# Altium schematic sheet stm32f103cb_hm_F100.SchDoc: Schemat z procesorem STM32F100CBT6
size A4; DocumentNumber: 2; SheetNumber: 2; SheetTotal: 4; LotOfPieces: 1
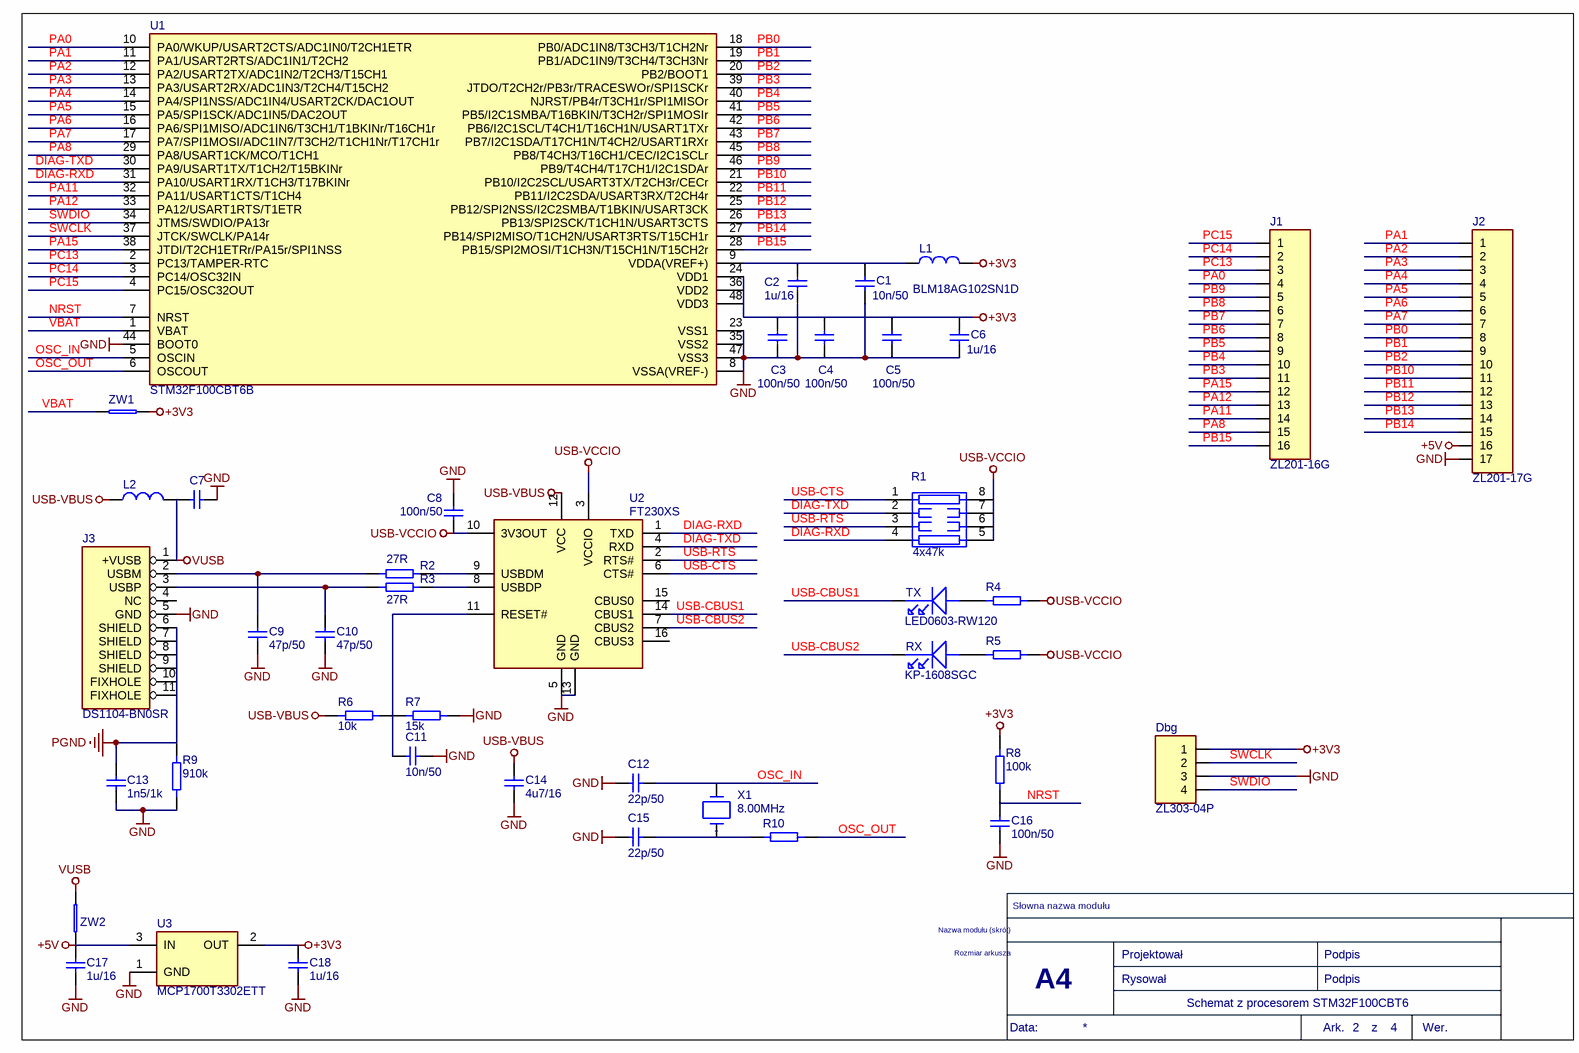
[diagram p0: stm32f103cb_hm_F100.SchDoc]

## Parts
C1  10n/50  [0603-IPC]  (graphical)
C2  1u/16  [0603-IPC]  (graphical)
C3  100n/50  [0603-IPC]  (graphical)
C4  100n/50  [0603-IPC]  (graphical)
C5  100n/50  [0603-IPC]  (graphical)
C6  1u/16  [0603-IPC]  (graphical)
C7  10n/50  [0603-IPC]  (value not drawn)  (graphical)
C8  100n/50  [0603-IPC]  (graphical)
C9  47p/50  [0603-IPC]  (graphical)
C10  47p/50  [0603-IPC]  (graphical)
C11  10n/50  [0603-IPC]  (graphical)
C12  22p/50  [0603-IPC]  (graphical)
C13  1n5/1k  [1210]  (graphical)
C14  4u7/16  [0805]  (graphical)
C15  22p/50  [0603-IPC]  (graphical)
C16  100n/50  [0603-IPC]  (graphical)
C17  1u/16  [0603-IPC]  (graphical)
C18  1u/16  [0603-IPC]  (graphical)
Dbg  ZL303-04P  [PLMS4S]  (graphical)
J1  ZL201-16G  [PLS16S]  (graphical)
J2  ZL201-17G  [PLS17S]  (graphical)
J3  DS1104-BN0SR  [USBMS1B5]  (graphical)
L1  BLM18AG102SN1D  [0603-IPC]  (graphical)
L2  BLM18AG102SN1D  [0603-IPC]  (value not drawn)  (graphical)
R1  4x47k  [1206RP]  (graphical)
R2  27R  [0603R]  (graphical)
R3  27R  [0603R]  (graphical)
R4  10k  [0603R]  (value not drawn)  (graphical)
R5  10k  [0603R]  (value not drawn)  (graphical)
R6  10k  [0603R]  (graphical)
R7  15k  [0603R]  (graphical)
R8  100k  [0603R]  (graphical)
R9  910k  [2512]  (graphical)
R10  220R  [0603R]  (value not drawn)  (graphical)
RX  KP-1608SGC  [D0603]  (graphical)
TX  LED0603-RW120  [D0603]  (graphical)
U1  STM32F100CBT6B  [MS-026ABC]  (graphical)
U2  FT230XS  [MO-137AB]  (graphical)
U3  MCP1700T3302ETT  [SOT23-3]  (graphical)
X1  8.00MHz  [HC49/4HSMX_THT]  (graphical)
ZW1  SHORT0805  [SHORT0805]  (value not drawn)  (graphical)
ZW2  SHORT0805  [SHORT0805]  (value not drawn)  (graphical)

## Nets
+3V3: C3.1 C4.1 C5.1 C6.1 C18.1 Dbg.1 L1.2 R8.1 U1.24(VDD1) U1.36(VDD2) U1.48(VDD3) U3.2(OUT) ZW1.2
+5V: C17.1 J2.16 U3.3(IN) ZW2.1
GND: C1.2 C2.2 C3.2 C4.2 C5.2 C6.2 C7.1 C8.1 C9.2 C10.2 C11.1 C12.1 C13.2 C14.2 C15.1 C16.2 C17.2 C18.2 Dbg.3 J2.17 J3.5(GND) R7.2 R9.2 U1.8(VSSA(VREF-)) U1.23(VSS1) U1.35(VSS2) U1.44(BOOT0) U1.47(VSS3) U2.5(GND) U2.13(GND) U3.1(GND)
PGND: C13.1 J3.6(SHIELD) J3.7(SHIELD) J3.8(SHIELD) J3.9(SHIELD) J3.10(FIXHOLE) J3.11(FIXHOLE) R9.1
USB-VBUS: C14.1 L2.2 R6.1 U2.12(VCC)
USB-VCCIO: C8.2 R1.5(R5) R1.6(R6) R1.7(R7) R1.8(R8) R4.2 R5.2 U2.3(VCCIO) U2.10(3V3OUT)
VUSB: C7.2 J3.1(+VUSB) L2.1 ZW2.2
DIAG-RXD: R1.4(R4) U1.31(PA10/USART1RX/T1CH3/T17BKINr) U2.1(TXD)
DIAG-TXD: R1.2(R2) U1.30(PA9/USART1TX/T1CH2/T15BKINr) U2.4(RXD)
NRST: C16.1 R8.2 U1.7(NRST)
OSC_IN: C12.2 U1.5(OSCIN) X1.1
OSC_OUT: R10.2 U1.6(OSCOUT)
PA0: J1.4 U1.10(PA0/WKUP/USART2CTS/ADC1IN0/T2CH1ETR)
PA1: J2.1 U1.11(PA1/USART2RTS/ADC1IN1/T2CH2)
PA2: J2.2 U1.12(PA2/USART2TX/ADC1IN2/T2CH3/T15CH1)
PA3: J2.3 U1.13(PA3/USART2RX/ADC1IN3/T2CH4/T15CH2)
PA4: J2.4 U1.14(PA4/SPI1NSS/ADC1IN4/USART2CK/DAC1OUT)
PA5: J2.5 U1.15(PA5/SPI1SCK/ADC1IN5/DAC2OUT)
PA6: J2.6 U1.16(PA6/SPI1MISO/ADC1IN6/T3CH1/T1BKINr/T16CH1r)
PA7: J2.7 U1.17(PA7/SPI1MOSI/ADC1IN7/T3CH2/T1CH1Nr/T17CH1r)
PA8: J1.15 U1.29(PA8/USART1CK/MCO/T1CH1)
PA11: J1.14 U1.32(PA11/USART1CTS/T1CH4)
PA12: J1.13 U1.33(PA12/USART1RTS/T1ETR)
PA15: J1.12 U1.38(JTDI/T2CH1ETRr/PA15r/SPI1NSS)
PB0: J2.8 U1.18(PB0/ADC1IN8/T3CH3/T1CH2Nr)
PB1: J2.9 U1.19(PB1/ADC1IN9/T3CH4/T3CH3Nr)
PB2: J2.10 U1.20(PB2/BOOT1)
PB3: J1.11 U1.39(JTDO/T2CH2r/PB3r/TRACESWOr/SPI1SCKr)
PB4: J1.10 U1.40(NJRST/PB4r/T3CH1r/SPI1MISOr)
PB5: J1.9 U1.41(PB5/I2C1SMBA/T16BKIN/T3CH2r/SPI1MOSIr)
PB6: J1.8 U1.42(PB6/I2C1SCL/T4CH1/T16CH1N/USART1TXr)
PB7: J1.7 U1.43(PB7/I2C1SDA/T17CH1N/T4CH2/USART1RXr)
PB8: J1.6 U1.45(PB8/T4CH3/T16CH1/CEC/I2C1SCLr)
PB9: J1.5 U1.46(PB9/T4CH4/T17CH1/I2C1SDAr)
PB10: J2.11 U1.21(PB10/I2C2SCL/USART3TX/T2CH3r/CECr)
PB11: J2.12 U1.22(PB11/I2C2SDA/USART3RX/T2CH4r)
PB12: J2.13 U1.25(PB12/SPI2NSS/I2C2SMBA/T1BKIN/USART3CK)
PB13: J2.14 U1.26(PB13/SPI2SCK/T1CH1N/USART3CTS)
PB14: J2.15 U1.27(PB14/SPI2MISO/T1CH2N/USART3RTS/T15CH1r)
PB15: J1.16 U1.28(PB15/SPI2MOSI/T1CH3N/T15CH1N/T15CH2r)
PC13: J1.3 U1.2(PC13/TAMPER-RTC)
PC14: J1.2 U1.3(PC14/OSC32IN)
PC15: J1.1 U1.4(PC15/OSC32OUT)
SWCLK: Dbg.2 U1.37(JTCK/SWCLK/PA14r)
SWDIO: Dbg.4 U1.34(JTMS/SWDIO/PA13r)
USB-CBUS1: TX.CATH U2.14(CBUS1)
USB-CBUS2: RX.CATH U2.7(CBUS2)
USB-CTS: R1.1(R1) U2.6(CTS#)
USB-RTS: R1.3(R3) U2.2(RTS#)
VBAT: U1.1(VBAT) ZW1.1
NetC1_1: C1.1 C2.1 L1.1 U1.9(VDDA(VREF+))
NetC9_1: C9.1 J3.2(USBM) R2.1
NetC10_1: C10.1 J3.3(USBP) R3.1
NetC11_2: C11.2 R6.2 R7.1 U2.11(RESET#)
NetC15_2: C15.2 R10.1 X1.2
NetR2_2: R2.2 U2.9(USBDM)
NetR3_2: R3.2 U2.8(USBDP)
NetR4_1: R4.1 TX.ANOD
NetR5_1: R5.1 RX.ANOD

Not connected (* = marked no-connect by the designer): J3 4(NC); U2 15(CBUS0) 16(CBUS3)

## Notes on the sheet
- Nazwa modułu (skrót)
- Słowna nazwa modułu
- Rozmiar arkusza
- A4
- Projektował
- Rysował
- Podpis
- Data:
- Ark.
- z
- Wer.

## Library data of the parts
C1 C7 C11 = CAP20: Descript: Kondensator: ceramiczny; MLCC; 10nF; 50V; X7R; ±10%; SMD; 0603; Reference5: 06035C103KAT2A; Kod: CAP20; ID: 20; Value: 10n/50; Supplier5: tme.pl; Manufacturer5: AVX; Typ5: 06035C103KAT2A; Price5: 0,08; DateOfPrice5: 2020-05-10
C2 C6 C17 C18 = CAP37: Descript: Kondensator: ceramiczny; MLCC; 1uF; 16V; X7R; ±10%; SMD; 0603; Reference5: CL10B105KO8NNNC; Kod: CAP37; ID: 37; Value: 1u/16; Supplier5: tme.pl; Manufacturer5: Samsung; Typ5: CL10B105KO8NNNC; Price5: 0,07; DateOfPrice5: 2020-05-10
C3-C5 C8 C16 = CAP6: Descript: Kondensator: ceramiczny; MLCC; 100nF; 50V; X7R; ±5%; SMD; 0603; Reference5: CL10B104JB8NNNC; Kod: CAP6; ID: 6; Value: 100n/50; Supplier5: tme.pl; Manufacturer5: Samsung; Typ5: CL10B104JB8NNNC; Price5: 0,25; DateOfPrice5: 2020-05-10
C9 C10 = CAP85: Descript: Kondensator: ceramiczny; MLCC; 47pF; 50V; C0G; ±5%; SMD; 0603; Reference5: CC0603JRNPO9470; Typ5: CC0603JRNPO9BN470; Kod: CAP85; ID: 85; Value: 47p/50; Supplier5: tme.pl; Manufacturer5: Yageo; Price5: 0,08; DateOfPrice5: 2020-05-10
C12 C15 = CAP53: Descript: Kondensator: ceramiczny; MLCC; 22pF; 50V; C0G; ±5%; SMD; 0603; Reference5: CC0603JRNPO9220; Typ5: CC0603JRNPO9BN220; Kod: CAP53; ID: 53; Value: 22p/50; Supplier5: tme.pl; Manufacturer5: Yageo; Price5: 0; DateOfPrice5: 2010-01-01
C13 = CAP35: Descript: Ceramiczny kondensator wielowarstw. SMD, 1210 [jedn. metryczne: 3225], 1500 pF, 1 kV, ± 10%, X7R; Reference5: 1855964; Typ5: MCCA000836; Kod: CAP35; ID: 35; Value: 1n5/1k; DateOfPrice5: 2020-05-10; Manufacturer5: MULTICOMP; Price5: 2,4; Supplier5: farnell.com
C14 = CAP97: Descript: Kondensator: ceramiczny; MLCC; 4,7uF; 16VDC; X7R; ±5%; SMD; 0805; Reference5: C0805C475J4RACAUTO; Kod: CAP97; ID: 97; Value: 4u7/16; Supplier5: tme.pl; Manufacturer5: Kemet; Typ5: C0805C475J4RACAUTO; Price5: 1,5; DateOfPrice5: 2020-05-10
Dbg = Con298: Descript: Listwa kołkowa; kołkowe; męskie; PIN:4; proste; 2mm; THT; 1x4; Kod: Con298; ID: 298; Replacement: bd; Value: ZL303-04P; Supplier5: tme.pl; Reference5: ZL303-04P; Manufacturer5: Ninigi; Typ5: ZL303-04P; Price5: 0,2; DateOfPrice5: 2020-05-10
J1 = CON81: Kod: CON81; ID: 81; Descript: Listwa kołkowa; kołkowe; męskie; PIN: 16; proste; 2,54mm; THT; 1x16; Typ5: DS1021-1*16SF11; Replacement: bd; Value: ZL201-16G; Price5: 0,7; DateOfPrice5: 2020-12-08; Supplier5: tme; Reference5: ZL201-16G; Manufacturer5: Connfly
J2 = CON82: Kod: CON82; ID: 82; Descript: Listwa kołkowa; kołkowe; męskie; PIN: 20; proste; 2,54mm; THT; 1x20; Reference5: ZL201-20G; Typ5: DS1021-1*20SF11; Replacement: bd; Value: ZL201-17G; Price5: 1; DateOfPrice5: 2020-12-08; Supplier5: tme; Manufacturer5: Connfly
J3 = Con41: Descript: Gniazdo; USB B mini; SMT; PIN: 5; poziome; Opakowanie: taśma; Reference5: MUSB-G5P; Replacement: bd; Kod: Con41; ID: 41; Value: DS1104-BN0SR; Supplier5: tme.pl; Manufacturer5: Connfly; Price5: 2; DateOfPrice5: 2010-01-01; Typ5: DS1104-BN0SR
L1 L2 = Ind41: Descript: Ferryt: koralik; Imp.@ 100MHz:1000om; Montaż: SMD; 0,4A; Obud:0603; Kod: Ind41; ID: 41; Value: BLM18AG102SN1D; Supplier5: tme.pl; Reference5: BLM18AG102SN1D; Manufacturer5: Murata; Typ5: BLM18AG102SN1D; Price5: 0; DateOfPrice5: 2020-05-10; InductCurr: -
R1 = Res182: Descript: Drabinka rezystorowa: Y; 47kΩ; SMD; 1206; Il.rezystorów:4; 63mW; Reference5: DR1206-47K-4/8; Typ5: 4D03WGJ0473T; Kod: Res182; ID: 182; Value: 4x47k; Supplier5: tme.pl; Manufacturer5: Royal Ohm; Price5: 0,1; DateOfPrice5: 2020-05-10
R2 R3 = Res106: Descript: Rezystor: thick film; SMD; 0603; 27Ω; 0,1W; ±1%; -55÷125°C; Reference5: SMD0603-27R-1%; Typ5: 0603SAF270JT5E; Kod: Res106; ID: 106; Value: 27R; Supplier5: tme.pl; Manufacturer5: Royal Ohm; Price5: 0,1; DateOfPrice5: 2020-05-10
R4-R6 = Res15: Descript: Rezystor: thick film; SMD; 0603; 10kom; 0,1W; ±1%; -55÷125°C; Reference5: SMD0603-10K-1%; Typ5: 0603WGF 10K T5E; Kod: Res15; ID: 15; Value: 10k; Supplier5: tme.pl; Manufacturer5: Royal Ohm; Price5: 0,08; DateOfPrice5: 2020-05-10
R7 = Res39: Descript: Rezystor: thick film; SMD; 0603; 15kΩ; 0,1W; ±1%; -55÷125°C; Reference5: SMD0603-15K-1%; Typ5: 0603WGF15KT5E; Kod: Res39; ID: 39; Value: 15k; Supplier5: tme.pl; Manufacturer5: Royal Ohm; Price5: 0,08; DateOfPrice5: 2020-05-10
R8 = Res9: Descript: Rezystor: thick film; SMD; 0603; 100kom; 0,1W; ±1%; -55÷125°C; Reference5: SMD0603-100K-1%; Typ5: 0603SAF1003T5E; Kod: Res9; ID: 9; Value: 100k; Supplier5: tme.pl; Manufacturer5: Royal Ohm; Price5: 0,1; DateOfPrice5: 2020-06-25
R9 = Res235: Descript: Rezystor SMD, grubowarstwowy, 2512 [jedn. metryczne: 6432], 910 kohm, Seria ERJU1T, 200 V; Reference5: 2381073; Typ5: ERJU1TF9103U; Kod: Res235; ID: 235; Value: 910k; Supplier5: farnell; Price5: 1,14; DateOfPrice5: 2020-05-10; Manufacturer5: Panasonic
R10 = Res87: Descript: Rezystor: thick film; SMD; 0603; 220om; 0,1W; ±1%; -55÷125°C; Reference5: SMD0603-220R-1%; Typ5: 0603SAF2200T5E; Kod: Res87; ID: 87; Value: 220R; Supplier5: tme.pl; Manufacturer5: Royal Ohm; Price5: 0,1; DateOfPrice5: 2020-06-25
RX = Opt8: Descript: LED; SMD; 0603; zielony; 4-15mcd; 120°; 1,6x0,8mm; Kod: Opt8; ID: 8; Value: KP-1608SGC; Supplier5: tme.pl; Reference5: KP-1608SGC; Manufacturer5: Kingbright Electronic; Typ5: KP-1608SGC; Price5: 0,8; DateOfPrice5: 2020-05-10
TX = Opt25: Descript: Dioda LED, SMD 0603, Czerwona 626-636nm, 50-70 mCd /10mA, water clear, 120°; Kod: Opt25; ID: 25; Value: LED0603-RW120; Supplier5: maritex.com.pl; Reference5: LED0603-RW120; Typ5: LED0603-RW120; Price5: 0,12; DateOfPrice5: 2020-05-10; Manufacturer5: Honglitronic
U1 = ICs268: Kod: ICs268; ID: 268; Descript: MCU, 32BIT, CORTEXM3, 128K FLASH, 48LQFP; Reference5: 1838512; Value: STM32F100CBT6B; Price5: 15; DateOfPrice5: 2010-01-01; Supplier5: farnell.com; Manufacturer5: ST; Typ5: STM32F100CBT6B
U2 = ICs109: Descript: Interfejs; USB-basic UART; Ilość pinów CBUS:4; tuba; SSOP16; Reference5: FT230XS-R; Kod: ICs109; ID: 109; Value: FT230XS; Supplier5: tme.pl; Manufacturer5: FTDI; Typ5: FT230XS-R; Price5: 8,8; DateOfPrice5: 2020-05-10
U3 = ICs182: Kod: ICs182; ID: 182; Descript: Stabilizator napięcia; LDO, nieregulowany; 3,3V; 0,25A; SOT23-3; Typ5: MCP1700T3302E/TT; Value: MCP1700T3302ETT; Price5: 1,8; DateOfPrice5: 2020-05-10; Supplier5: tme.pl; Reference5: MCP1700T3302ETT; Manufacturer5: Microchip
X1 = Qua16: Descript: Rezonator: kwarcowy; 8MHz; ±30ppm; 20pF; SMD; HC49SM; Reference5: 8.00M-SMDHC49S; Kod: Qua16; ID: 16; Value: 8.00MHz; Supplier5: tme.pl; Manufacturer5: YIC; Price5: 2; DateOfPrice5: 2020-05-10; Freq: -
ZW1 ZW2 = Res238: Kod: Res238; ID: 238; Descript: Przewlekana zwora z drutu na planie rezystora 0805; Value: SHORT0805; Price5: 0,1; Supplier5: -; Reference5: -; Manufacturer5: -; Typ5: -